# EAGLE design touch (EAGLE 6.1)
APVD: B.F (14-12-21); DOC_ID: CLK-SCH-02; DOC_PART_NO: CLK-PC-02; DOC_REV: B; DOC_TITLE: Touch keypad; PROJECT_NAME: Alarm Clock
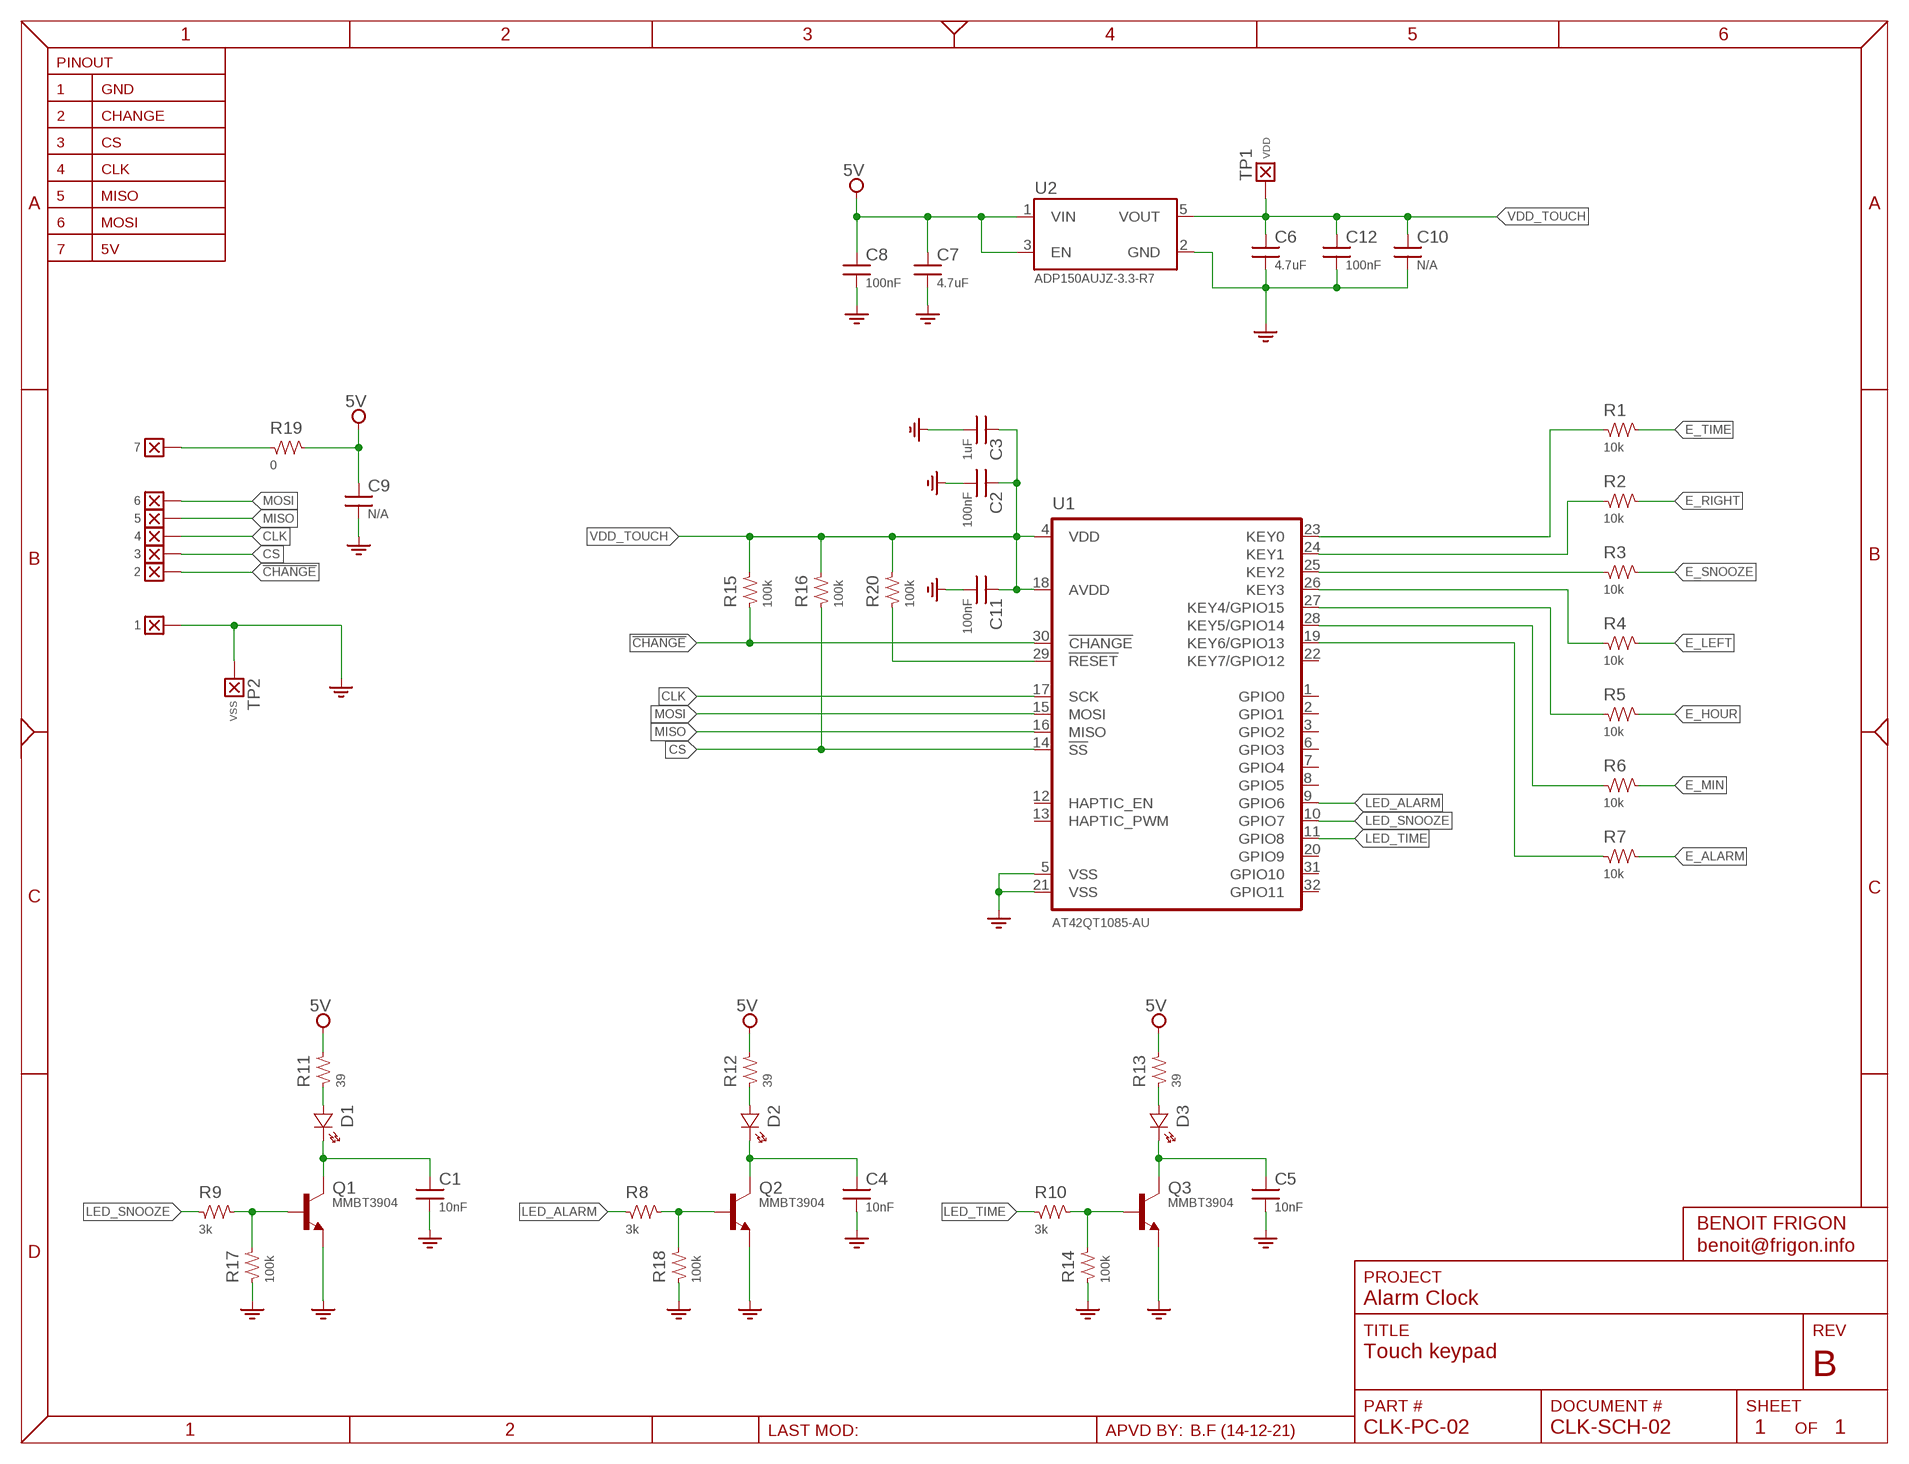
[diagram p0: schematic, sheet 1]

## Parts
5V  7  WIRE-150X75  [WIRE_SMT_150X75]
!CHANGE  2  WIRE-125X50  [WIRE_SMT_125X50]
C1  10nF  CAP-0603  [SMD_0603]
C2  100nF  CAP-0603  [SMD_0603]
C3  1uF  CAP-1206  [SMD_1206]
C4  10nF  CAP-0603  [SMD_0603]
C5  10nF  CAP-0603  [SMD_0603]
C6  4.7uF  CAP-1206  [SMD_1206]
C7  4.7uF  CAP-1206  [SMD_1206]
C8  100nF  CAP-0603  [SMD_0603]
C9  N/A  CAP-1206  [SMD_1206]
C10  N/A  CAP-1206  [SMD_1206]
C11  100nF  CAP-0603  [SMD_0603]
C12  100nF  CAP-0603  [SMD_0603]
CLK  4  WIRE-125X50  [WIRE_SMT_125X50]
CS  3  WIRE-125X50  [WIRE_SMT_125X50]
D1  {ATTR:COLOR}  LR-P47F  [P47F]
D2  {ATTR:COLOR}  LR-P47F  [P47F]
D3  {ATTR:COLOR}  LR-P47F  [P47F]
GND  1  WIRE-150X75  [WIRE_SMT_150X75]
MISO  5  WIRE-125X50  [WIRE_SMT_125X50]
MOSI  6  WIRE-125X50  [WIRE_SMT_125X50]
Q1  MMBT3904  [SOT23]
Q2  MMBT3904  [SOT23]
Q3  MMBT3904  [SOT23]
R1  10k  RES-0603  [SMD_0603]
R2  10k  RES-0603  [SMD_0603]
R3  10k  RES-0603  [SMD_0603]
R4  10k  RES-0603  [SMD_0603]
R5  10k  RES-0603  [SMD_0603]
R6  10k  RES-0603  [SMD_0603]
R7  10k  RES-0603  [SMD_0603]
R8  3k  RES-0603  [SMD_0603]
R9  3k  RES-0603  [SMD_0603]
R10  3k  RES-0603  [SMD_0603]
R11  39  RES-0603  [SMD_0603]
R12  39  RES-0603  [SMD_0603]
R13  39  RES-0603  [SMD_0603]
R14  100k  RES-0603  [SMD_0603]
R15  100k  RES-0603  [SMD_0603]
R16  100k  RES-0603  [SMD_0603]
R17  100k  RES-0603  [SMD_0603]
R18  100k  RES-0603  [SMD_0603]
R19  0  RES-1206  [SMD_1206]
R20  100k  RES-0603  [SMD_0603]
TP1  VDD  TEST_POINT-050  [TP_050]
TP2  VSS  TEST_POINT-050  [TP_050]
U1  AT42QT1085-AU  [TQFP-7X7-32]
U2  ADP150AUJZ-3.3-R7  [SOT23-5]

## Nets
5V: C7.1 C8.1 C9.1 R11.2 R12.2 R13.2 R19.2 U2.1(VIN) U2.3(EN)
!CHANGE: !CHANGE.1 R15.1 U1.30(!CHANGE)
CLK: CLK.1 U1.17(SCK)
CS: CS.1 R16.1 U1.14(!SS)
E_ALARM: R7.2
E_HOUR: R5.2
E_LEFT: R4.2
E_MIN: R6.2
E_RIGHT: R2.2
E_SNOOZE: R3.2
E_TIME: R1.2
GND: C1.2 C2.2 C3.2 C4.2 C5.2 C6.2 C7.2 C8.2 C9.2 C10.2 C11.2 C12.2 GND.1 Q1.2(E) Q2.2(E) Q3.2(E) R14.1 R17.1 R18.1 TP2.1 U1.5(VSS) U1.21(VSS) U2.2(GND)
LED_ALARM: R8.1 U1.9(GPIO6)
LED_SNOOZE: R9.1 U1.10(GPIO7)
LED_TIME: R10.1 U1.11(GPIO8)
MISO: MISO.1 U1.16(MISO)
MOSI: MOSI.1 U1.15(MOSI)
N$1: C1.1 D1.K Q1.3(C)
N$2: C4.1 D2.K Q2.3(C)
N$3: C5.1 D3.K Q3.3(C)
N$4: D1.A R11.1
N$5: D2.A R12.1
N$6: D3.A R13.1
N$7: R1.1 U1.23(KEY0)
N$8: R2.1 U1.24(KEY1)
N$9: R3.1 U1.25(KEY2)
N$10: R4.1 U1.26(KEY3)
N$11: R5.1 U1.27(KEY4/GPIO15)
N$12: R6.1 U1.28(KEY5/GPIO14)
N$13: R7.1 U1.19(KEY6/GPIO13)
N$14: Q3.1(B) R10.2 R14.2
N$15: Q2.1(B) R8.2 R18.2
N$16: Q1.1(B) R9.2 R17.2
N$18: 5V.1 R19.1
N$19: R20.1 U1.29(!RESET)
VDD_TOUCH: C2.1 C3.1 C6.1 C10.1 C11.1 C12.1 R15.2 R16.2 R20.2 TP1.1 U1.4(VDD) U1.18(AVDD) U2.5(VOUT)
Unconnected: U1.1(GPIO0) U1.2(GPIO1) U1.3(GPIO2) U1.6(GPIO3) U1.7(GPIO4) U1.8(GPIO5) U1.12(HAPTIC_EN) U1.13(HAPTIC_PWM) U1.20(GPIO9) U1.22(KEY7/GPIO12) U1.31(GPIO10) U1.32(GPIO11)

## Library data of the parts
5V !CHANGE CLK CS GND MISO MOSI = Misc:WIRE-?: Wire solder pad; BOM: FALSE
C1 C2 C4 C5 C8 C11 C12 = Passive:CAP: Capacitor; DESCRIPTION: {DESCRIPTION} - SMT 0603 - {value}; PACKAGE: SMT 0603
C3 C6 C7 C9 C10 = Passive:CAP: Capacitor; DESCRIPTION: {DESCRIPTION} - SMT 1206 - {value}; PACKAGE: SMT 1206
D1-D3 = Optoelectronic:*-P47F: SMT LED 2mm - Bottom entry; COLOR: Red; DESCRIPTION: {DESCRIPTION} - Red; MFG: OSRAM
Q1-Q3 = Transistor:MMBT3904: NPN Transistor
R1-R18 R20 = Passive:RES: Resistor; DESCRIPTION: {DESCRIPTION} - SMT 0603 - {VALUE}; PACKAGE: SMT 0603
R19 = Passive:RES: Resistor; DESCRIPTION: {DESCRIPTION} - SMT 1206 - {VALUE}; PACKAGE: SMT 1206
TP1 TP2 = Misc:TEST_POINT; BOM: FALSE
U1 = IC:AT42QT1085-?: 8 Key QTouch touch sensor
U2 = Power:ADP150A?Z-*-R7: Ultralow Noise, 150 mA CMOS Linear Regulator FEATURES Ultra low noise: 9 uV rms, independent of VOUT No additional noise bypass capacitor required Stable with 1 uF ceramic input and output capacitors Maximum output current: 150 mA Input voltage range: 2.2 V to 5.5 V Low quiescent current IGND = 10 ?A with zero load Low shutdown current: <1 uA Low dropout voltage: 105 mV @ 150 mA load Initial output voltage accuracy: ±1% Up to 14 fixed output voltage options: 1.8 V to 3.3 V PSRR performance of 70 dB at 10 kHz Current limit and thermal overload protection Logic-controlled enable 5-lead TSOT package 4-ball, 0.8 mm × 0.8 mm, 0.4 mm pitch WLCSP; DESCRIPTION: {DESCRIPTION} - 3.3v; MFG: Analog Devices; VOUT: 3.3v

## Board
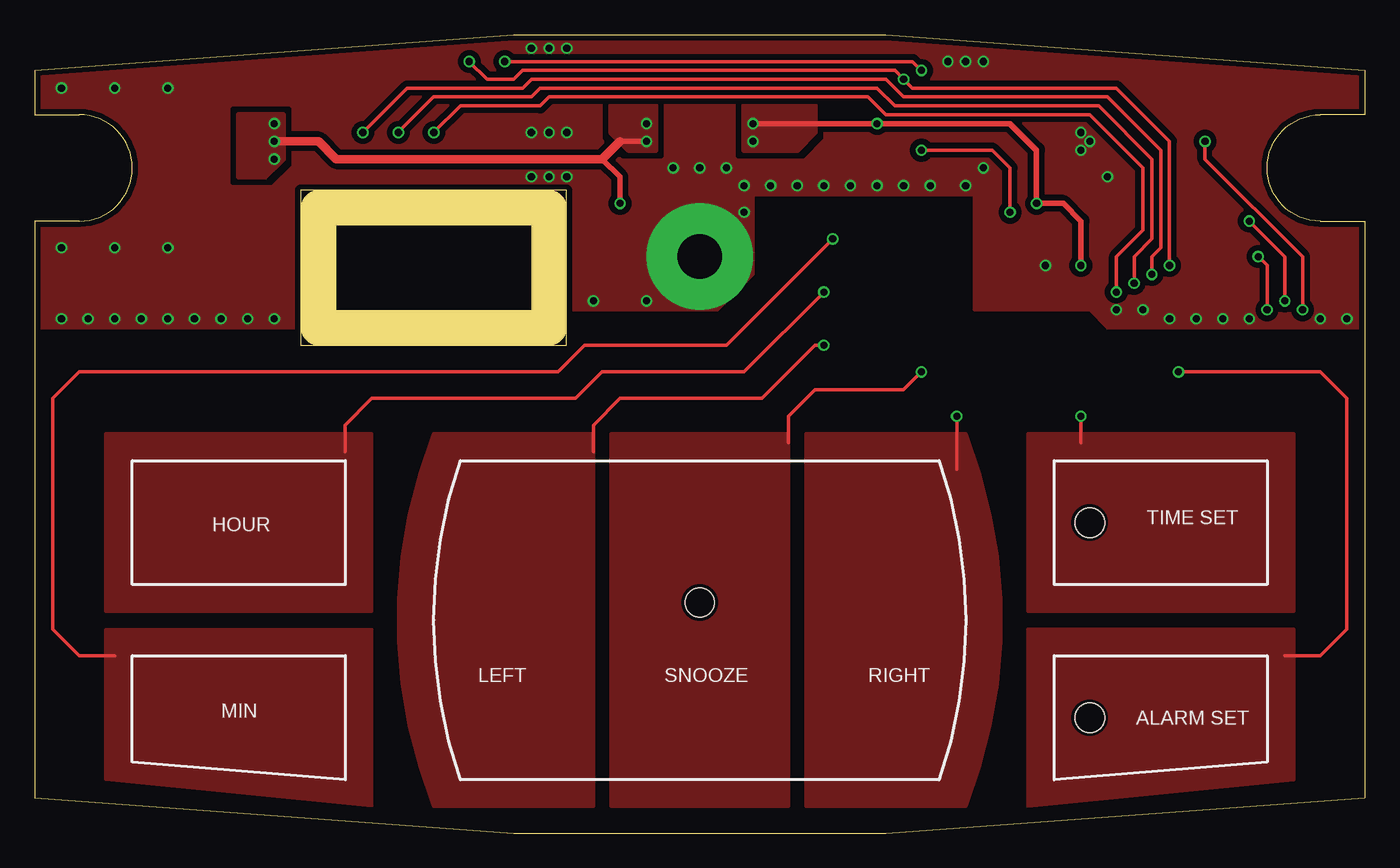
[diagram p1: board, top side]
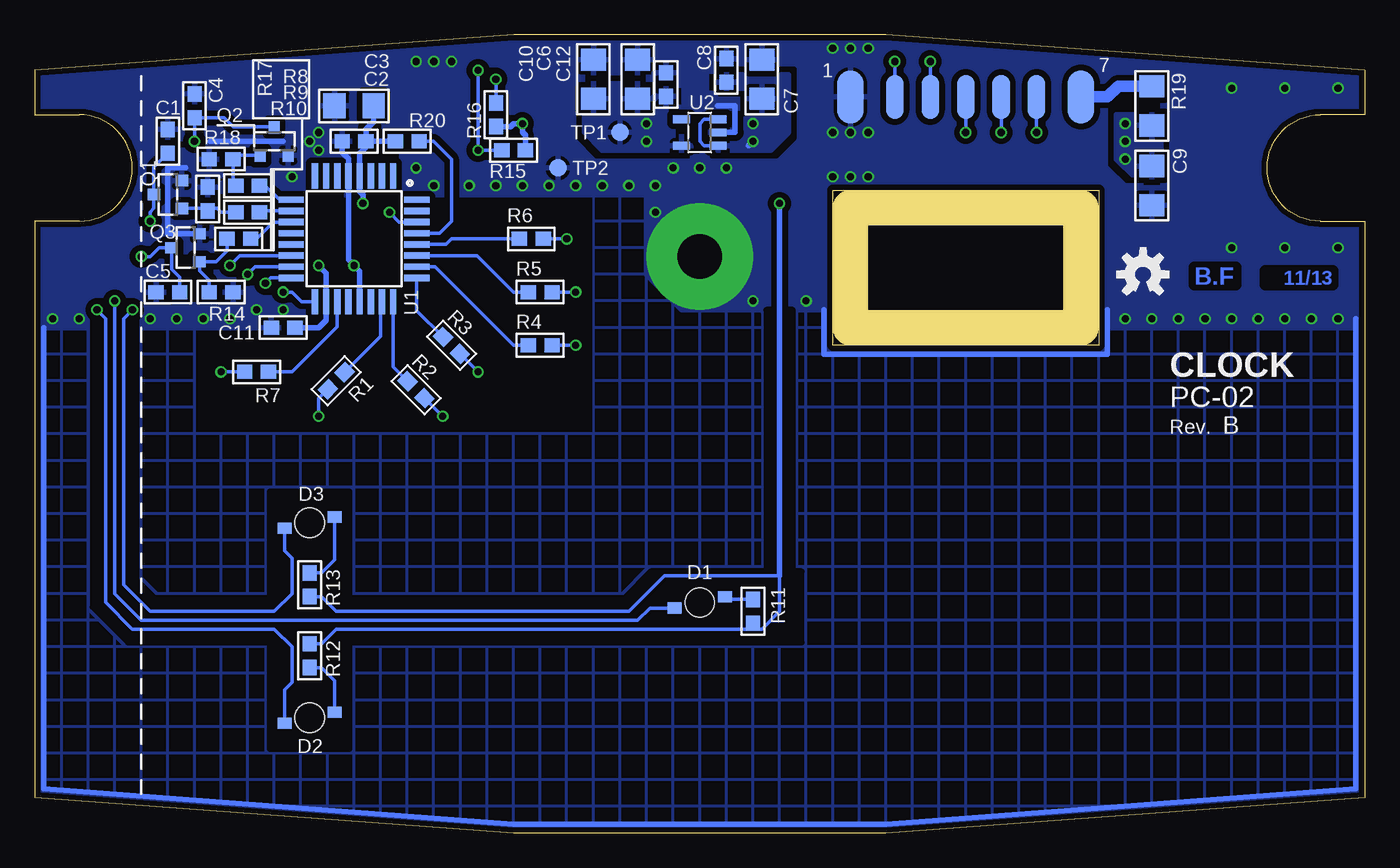
[diagram p2: board, bottom side, seen from below]

Size 95.25 x 57.15 mm. Coordinates in mm from the lower left corner, seen from the top.
Outline: 0,54.61 0,51.44 3.17,51.44 arc-180 3.17,43.81 0,43.81 0,2.54 34.29,0 60.96,0 95.25,2.54 95.25,43.81 92.08,43.81 arc-180 92.08,51.44 95.25,51.44 95.25,54.61 60.96,57.15 34.29,57.15 0,54.61
Outline: 19.05,46.04 19.05,34.92 38.1,34.92 38.1,46.04 19.05,46.04
Copper layers (1*16): Top 0.035mm / dielectric 1.5mm / Bottom 0.035mm
Design rules: minimum track width 5mil, minimum drill 12mil, track to track 5mil, track to pad 5mil, pad to pad 5mil, via to via 5mil, smd to smd 0mil, copper to edge 10mil, drill to drill 10mil, minimum pad ring 10mil, minimum via ring 6mil, stop-mask expansion 2mil, vias tented up to drill 25mil, thermal gap 10mil
bKeepout: area 87.6,1.9 to 95.2,55.2; area 19.1,46.4 to 38.1,57.2; area 0,41.9 to 13.3,53.3
bRestrict: area 9.5,39.2 to 12.2,40.5; area 2.4,39.2 to 7.1,40.3
Milling: 4 lines

### Footprints (pad centres in the part's own frame; a part is rotated, then mirrored left to right if it is on the bottom)
WIRE_SMT_150X75 = smd 3.81 x 1.905: 1 0,0
WIRE_SMT_125X50 = smd 3.175 x 1.27: 1 0,0
SMD_0603 = smd 1.1 x 1: 1 -0.85,0; 2 0.85,0
SMD_1206 = smd 1.6 x 1.8: 1 -1.4,0; 2 1.4,0
P47F = smd 1 x 0.8: A -1.8,-0.4; K 1.8,0.4 | hole 2.1: 0,0
SOT23 = smd 0.8 x 0.9: 1 -1,-1; 2 1,-1; 3 0,1
TP_050 = smd 1.27 x 1.27: 1 0,0
TQFP-7X7-32 = smd 1.8 x 0.45: 1 -4.5,2.8; 2 -4.5,2; 3 -4.5,1.2; 4 -4.5,0.4; 5 -4.5,-0.4; 6 -4.5,-1.2; 7 -4.5,-2; 8 -4.5,-2.8; 17 4.5,-2.8; 18 4.5,-2; 19 4.5,-1.2; 20 4.5,-0.4; 21 4.5,0.4; 22 4.5,1.2; 23 4.5,2; 24 4.5,2.8 | smd 0.45 x 1.8: 9 -2.8,-4.5; 10 -2,-4.5; 11 -1.2,-4.5; 12 -0.4,-4.5; 13 0.4,-4.5; 14 1.2,-4.5; 15 2,-4.5; 16 2.8,-4.5; 25 2.8,4.5; 26 2,4.5; 27 1.2,4.5; 28 0.4,4.5; 29 -0.4,4.5; 30 -1.2,4.5; 31 -2,4.5; 32 -2.8,4.5
SOT23-5 = smd 0.55 x 1.2: 1 -0.95,-1.3; 2 0,-1.3; 3 0.95,-1.3; 4 0.95,1.3; 5 -0.95,1.3

### Placement (x,y rotation side)
5V  20.32,52.7 270 bottom
!CHANGE  33.66,52.7 270 bottom
C1  85.72,49.53 90 bottom
C2  72.39,49.53 180 bottom
C3  72.39,52.07 180 bottom
C4  83.82,52.07 90 bottom
C5  85.72,38.73 180 bottom
C6  52.07,53.97 90 bottom
C7  43.18,53.97 90 bottom
C8  45.72,54.61 90 bottom
C9  15.24,46.36 270 bottom
C10  55.24,53.97 90 bottom
C11  77.47,36.2 180 bottom
C12  50.04,53.59 90 bottom
CLK  28.57,52.7 90 bottom
CS  31.11,52.7 270 bottom
D1  47.62,16.51 180 bottom
D2  75.56,8.25 180 bottom
D3  75.56,22.23 180 bottom
GND  36.83,52.7 90 bottom
MISO  26.04,52.7 90 bottom
MOSI  23.5,52.7 90 bottom
Q1  85.72,45.72 90 bottom
Q2  78.11,49.53 0 bottom
Q3  84.45,41.91 90 bottom
R1  73.66,32.38 225 bottom
R2  67.94,31.75 315 bottom
R3  65.41,34.92 315 bottom
R4  59.05,34.92 0 bottom
R5  59.05,38.73 0 bottom
R6  59.69,42.55 0 bottom
R7  79.38,33.02 180 bottom
R8  80.01,46.36 180 bottom
R9  80.01,44.45 180 bottom
R10  80.65,42.55 180 bottom
R11  43.81,15.88 270 bottom
R12  75.56,12.7 90 bottom
R13  75.56,17.78 270 bottom
R14  81.91,38.73 180 bottom
R15  60.96,48.89 0 bottom
R16  62.23,51.44 270 bottom
R17  82.87,45.4 270 bottom
R18  81.91,48.26 0 bottom
R19  15.24,52.07 270 bottom
R20  68.58,49.53 180 bottom
TP1  53.34,50.16 0 bottom
TP2  57.78,47.62 0 bottom
U1  72.39,42.55 270 bottom
U2  47.62,50.16 90 bottom
U$3  [INFO_COMPACT]  8.89,31.11 0 bottom
U$5  [OPENHW_LOGO_150]  15.88,40 0 bottom

### Tracks (layer width: path | path; a pad name or v marks a point on that pad's centre or on a via)
5V  (via drill 0.51)
  Top 0.406: 41.91,49.53 v43.81,49.53 | v41.91,45.09 41.91,46.99 40.64,48.26
  Top 0.61: v17.14,49.53 20.32,49.53 21.59,48.26 40.64,48.26 41.91,49.53
  Bottom 0.254: 43.81,14.6 73.66,14.6 74.72,13.55 R12.2 | 43.81,14.6 43.18,14.6 41.91,15.88 41.91,18.41 50.16,18.41 52.7,15.88 73.66,15.88 74.72,16.93 R13.2 | R11.2 43.81,14.6 | U2.3 47.31,51.11 47.62,50.8 47.62,49.53 47.31,49.22 U2.1
  Bottom 0.406: v41.91,45.09 41.91,18.41 | 44.13,49.22 v43.81,49.53
  other vias: 43.81,50.8 17.14,48.26 17.14,50.8
  pour Bottom (isolate 0.406, rank 2): 46.35,51.12 44.13,51.12 44.13,53.34 46.35,53.34 46.35,54.29 41.27,54.29 41.27,50.16 42.55,48.89 46.35,48.89
  pour Top (isolate 0.406, rank 2): 42.55,48.89 41.27,50.16 41.27,52.07 44.45,52.07 44.45,48.89
  pour Bottom (isolate 0.61, rank 2): 14.6,51.44 14.6,46.99 16.51,46.99 17.78,48.26 17.78,51.44
  pour Top (isolate 0.61, rank 2): 14.6,51.44 14.6,46.99 16.51,46.99 17.78,48.26 17.78,51.44
!CHANGE  (via drill 0.51)
  Top 0.254: v69.85,44.45 69.85,47.62 68.58,48.89 v63.5,48.89 | v63.5,54.61 62.87,55.25 v33.66,55.25
  Bottom 0.254: U1.30 69.14,43.74 v69.85,44.45 | v63.5,54.61 v63.5,48.89 R15.1 | !CHANGE.1 v33.66,55.25
CLK  (via drill 0.51)
  Top 0.254: v77.47,38.73 77.47,41.27 79.38,43.18 79.38,47.62 75.56,51.44 60.96,51.44 59.69,52.7 36.83,52.7 36.2,52.07 30.48,52.07 v28.57,50.16
  Bottom 0.254: U1.17 76.14,38.05 76.84,38.73 v77.47,38.73 | CLK.1 v28.57,50.16
CS  (via drill 0.51)
  Top 0.254: v81.28,40.64 81.28,49.53 77.47,53.34 62.87,53.34 v62.23,53.97 61.59,54.61 34.92,54.61 34.29,53.97 32.38,53.97 v31.11,55.25
  Bottom 0.254: U1.14 80.58,41.34 v81.28,40.64 | CS.1 v31.11,55.25 | R16.1 v62.23,53.97
E_ALARM  (via drill 0.51)
  Top 0.254: 89.53,12.7 92.08,12.7 93.98,14.6 93.98,31.11 92.08,33.02 v81.91,33.02
  Bottom 0.254: v81.91,33.02 R7.2
  pour Top: 71.12,14.6 90.17,14.6 90.17,3.81 71.12,1.9
E_HOUR  (via drill 0.51)
  Top 0.254: 22.23,27.3 22.23,29.21 24.13,31.11 38.73,31.11 40.64,33.02 50.8,33.02 v56.52,38.73
  Bottom 0.254: R5.2 v56.52,38.73
  pour Top: 5.08,15.88 5.08,28.57 24.13,28.57 24.13,15.88
E_LEFT  (via drill 0.51)
  Top 0.254: 40.01,27.3 40.01,29.21 41.91,31.11 52.07,31.11 55.88,34.92 v56.52,34.92
  Bottom 0.254: R4.2 v56.52,34.92
  pour Top (isolate 0.305): 28.57,1.9 arc-43 28.57,28.57 40.01,28.57 40.01,1.9
E_MIN  (via drill 0.51)
  Top 0.254: 5.72,12.7 3.17,12.7 1.27,14.6 1.27,31.11 3.17,33.02 37.47,33.02 39.37,34.92 49.53,34.92 v57.15,42.55
  Bottom 0.254: R6.2 v57.15,42.55
  pour Top: 5.08,14.6 24.13,14.6 24.13,1.9 5.08,3.81
E_RIGHT  (via drill 0.51)
  Top 0.254: 66.04,26.04 v66.04,29.84
  Bottom 0.254: v66.04,29.84 R2.2
  pour Top (isolate 0.305): 66.67,1.9 55.24,1.9 55.24,28.57 66.67,28.57 arc-43
E_SNOOZE  (via drill 0.51)
  Top 0.254: 53.98,27.94 53.98,29.84 55.88,31.75 62.23,31.75 v63.5,33.02
  Bottom 0.254: v63.5,33.02 | v63.5,33.02 R3.2
  pour Top: 53.98,1.9 41.27,1.9 41.27,28.57 53.98,28.57
E_TIME  (via drill 0.51)
  Top 0.254: 74.93,27.94 v74.93,29.84
  Bottom 0.254: R1.2 74.93,31.11 v74.93,29.84
  pour Top: 71.12,15.88 71.12,28.57 90.17,28.57 90.17,15.88
GND  (via drill 0.51, 3.17 pad 7.62)
  Bottom 0.406: U1.21 71.99,40.24 72.79,41.04 U1.5 72.79,48.28 73.24,48.73 C2.2 | 0.63,36.83 0.63,3.18 34.29,0.63 60.96,0.63 94.62,3.18 94.62,36.2 | Q3.2 85.72,42.91 85.72,47.62 84.45,47.62 | 82.68,49.53 77.47,49.53 | 18.41,37.47 18.41,34.29 38.73,34.29 38.73,37.47 | U2.2 45.09,50.16 45.09,52.07 46.35,52.07
  other vias: 47.62,41.27 1.91,36.83 3.81,36.83 5.72,36.83 7.62,36.83 9.52,36.83 11.43,36.83 13.34,36.83 15.24,36.83 17.14,36.83 40.01,38.1 52.7,46.36 54.61,46.36 56.52,46.36 58.42,46.36 74.93,48.89 74.93,50.16 75.56,49.53 60.33,46.36 62.23,46.36 64.14,46.36 66.67,46.36 50.8,46.36 43.81,38.1 85.09,36.83 83.19,36.83 81.28,36.83 79.38,37.47 87,36.83 50.8,44.45 92.08,36.83 93.98,36.83 35.56,56.2 36.83,56.2 38.1,56.2 35.56,50.16 36.83,50.16 38.1,50.16 35.56,46.99 36.83,46.99 38.1,46.99 1.91,41.91 5.72,41.91 9.52,41.91 1.91,53.34 5.72,53.34 9.52,53.34 76.84,46.99 66.67,55.25 65.41,55.25 67.94,55.25 77.47,37.47 72.39,40.64 45.72,47.62 47.62,47.62 49.53,47.62 67.94,47.62
  pour Bottom (isolate 0.406, rank 3): 0,57.15 95.25,57.78 95.25,36.2 76.84,36.2 75.56,37.47 75.56,45.72 51.44,45.72 51.44,40 48.9,37.47 38.1,37.47 38.1,36.2 0,36.2
  pour Bottom (isolate 0.406, hatched): 0,0 0,36.2 19.05,36.2 19.05,34.92 38.1,34.92 38.1,37.47 48.9,37.47 51.44,40 51.44,45.72 55.24,45.72 55.24,28.57 83.82,28.57 83.82,36.2 95.25,36.2 95.25,0
  pour Top (isolate 0.406, rank 5): 67.31,45.72 67.31,37.47 75.56,37.47 76.84,36.2 95.25,36.2 95.25,57.15 0,57.15 0,36.2 38.1,36.2 38.1,37.47 48.9,37.47 51.44,40 51.44,45.72
  pour Bottom (isolate 0.406, rank 3): 0,57.15 95.25,57.78 95.25,36.2 76.84,36.2 75.56,37.47 75.56,45.72 51.44,45.72 51.44,40 48.9,37.47 38.1,37.47 38.1,36.2 0,36.2
LED_ALARM
  Bottom 0.254: U1.9 77.73,45.34 78.74,46.36 R8.1
LED_SNOOZE
  Bottom 0.254: U1.10 79.16,44.55 R9.1
LED_TIME
  Bottom 0.254: U1.11 78.17,43.74 79.38,42.55 R10.1
MISO  (via drill 0.51)
  Top 0.254: v78.74,39.37 78.74,41.27 80.01,42.55 80.01,48.26 76.2,52.07 61.59,52.07 60.33,53.34 36.2,53.34 35.56,52.7 28.57,52.7 v26.04,50.16
  Bottom 0.254: U1.16 78.36,39.74 v78.74,39.37 | MISO.1 v26.04,50.16
MOSI  (via drill 0.51)
  Top 0.254: v80.01,40 80.01,41.27 80.65,41.91 80.65,48.89 76.84,52.7 62.23,52.7 60.96,53.97 35.56,53.97 34.92,53.34 26.67,53.34 v23.5,50.16
  Bottom 0.254: U1.15 79.47,40.55 v80.01,40 | v23.5,50.16 MOSI.1
N$1  (via drill 0.51)
  Top 0.254: v89.53,38.1 89.53,41.27 v87,43.81
  Bottom 0.254: v89.53,38.1 89.53,17.14 87.63,15.24 52.07,15.24 51.2,16.11 D1.K | C1.1 86.72,47.68 Q1.3 86.72,44.72 87,44.45 v87,43.81
N$2  (via drill 0.51)
  Top 0.254: v90.81,37.47 90.81,41.27 83.82,48.26 v83.82,49.53
  Bottom 0.254: v90.81,37.47 90.17,36.83 90.17,16.51 88.27,14.6 78.11,14.6 76.84,13.33 76.84,10.79 77.36,10.27 D2.K | v83.82,49.53 C4.1 81.7,51.22 81.06,50.59 78.11,50.59 Q2.3
N$3  (via drill 0.51)
  Top 0.254: v88.27,37.47 88.27,40.64 v87.63,41.27
  Bottom 0.254: v88.27,37.47 88.9,36.83 88.9,17.78 87,15.88 78.11,15.88 76.84,17.14 76.84,19.68 77.36,20.21 D3.K | v87.63,41.27 87,41.27 86.36,41.91 Q3.3 85.45,40.37 84.88,39.79 C5.1
N$4
  Bottom 0.254: D1.A 45.48,16.91 45.48,16.73 R11.1
N$5
  Bottom 0.254: D2.A 73.77,10.9 74.72,11.85 R12.1
N$6
  Bottom 0.254: D3.A 73.77,19.58 74.72,18.63 R13.1
N$7
  Bottom 0.254: U1.23 70.48,37.95 70.48,35.56 R1.1
N$8
  Bottom 0.254: U1.24 69.59,33.39 69.22,33.02 R2.1
N$9
  Bottom 0.254: U1.25 67.89,37.41 R3.1
N$10
  Bottom 0.254: U1.26 66.58,40.55 60.96,34.92 R4.1
N$11
  Bottom 0.254: U1.27 63.57,41.34 60.96,38.73 R5.1
N$12
  Bottom 0.254: U1.28 65.81,42.14 65.41,42.55 R6.1
N$13
  Bottom 0.254: U1.19 73.59,36.27 76.84,33.02 R7.1
N$14
  Bottom 0.254: R10.2 81.5,41.7 82.28,40.91 Q3.1 83.45,40.27 82.77,39.59 R14.2
N$15
  Bottom 0.254: Q2.1 80.8,48.53 R18.2 81.06,46.36 R8.2
N$16
  Bottom 0.254: R9.2 81.91,44.45 82.19,44.72 82.87,44.72 | Q1.1 82.87,44.72 | R17.2 82.87,44.72
N$17
  cutout Bottom: 87.95,36.83 91.12,36.83 91.12,16.19 88.58,13.65 78.42,13.65 78.42,6.03 72.71,6.03 72.71,13.65 40.32,13.65 40.32,18.73 40.96,18.73 40.96,37.47 42.86,37.47 42.86,18.73 51.12,18.73 53.02,16.83 72.71,16.83 72.71,24.45 78.42,24.45 78.42,16.83 86.68,16.83 87.95,18.1
N$18
  Bottom 0.813: R19.1 17.65,53.47 18.41,52.7 5V.1
N$19
  Bottom 0.254: R20.1 66.67,49.53 65.41,48.26 65.41,43.81 66.28,42.95 U1.29
VDD_TOUCH  (via drill 0.51)
  Top 0.406: v74.93,40.64 74.93,43.81 73.66,45.09 v71.75,45.09 71.75,48.89 69.85,50.8 v60.33,50.8 v51.44,50.8
  Bottom 0.406: v74.93,40.64 74.39,40.1 U1.18 74.39,36.73 74.93,36.2 C11.1 | v71.75,45.09 71.75,45.72 71.99,45.95 U1.4 71.99,48.66 71.54,49.11 C2.1 | C3.1 70.99,50.93 71.54,50.38 C2.1 | R16.2 61.17,50.59 60.96,50.8 v60.33,50.8 60.33,50.16 60.11,49.95 R15.2 | R20.2 C2.1
  other vias: 51.44,49.53
  pour Bottom (isolate 0.406, rank 2): 48.26,48.89 48.26,49.85 49.53,49.85 49.53,53.66 55.88,53.66 55.88,50.16 54.61,48.89
  pour Top (isolate 0.406): 50.8,48.89 50.8,52.07 55.88,52.07 55.88,50.16 54.61,48.89

### Text on the board
Bottom: B.F
tPlace: TIME SET | HOUR | LEFT | SNOOZE | RIGHT | MIN | ALARM SET
bPlace: 7 | 1
bStop: B.F
_tsilk: TIME SET | HOUR | LEFT | SNOOZE | RIGHT | MIN | ALARM SET
_bsilk: C12 | C6 | C10 | R17 | R19 | 7 | 1 | C8 | C3 | C4 | C7 | C2 | R8 | R9 | U2 | R20 | R10 | Q2 | C1 | TP1 | R16 | R18 | C9 | TP2 | R15 | Q1 | R6 | Q3 | C5 | R5 | U1 | R14 | R4 | R3 | C11 | R2 | CLOCK | R1 | R7 | PC-02 | B | Rev. | D3 | D1 | R13 | R11 | R12 | D2